# EAGLE design hawb-hat (EAGLE 6.4)
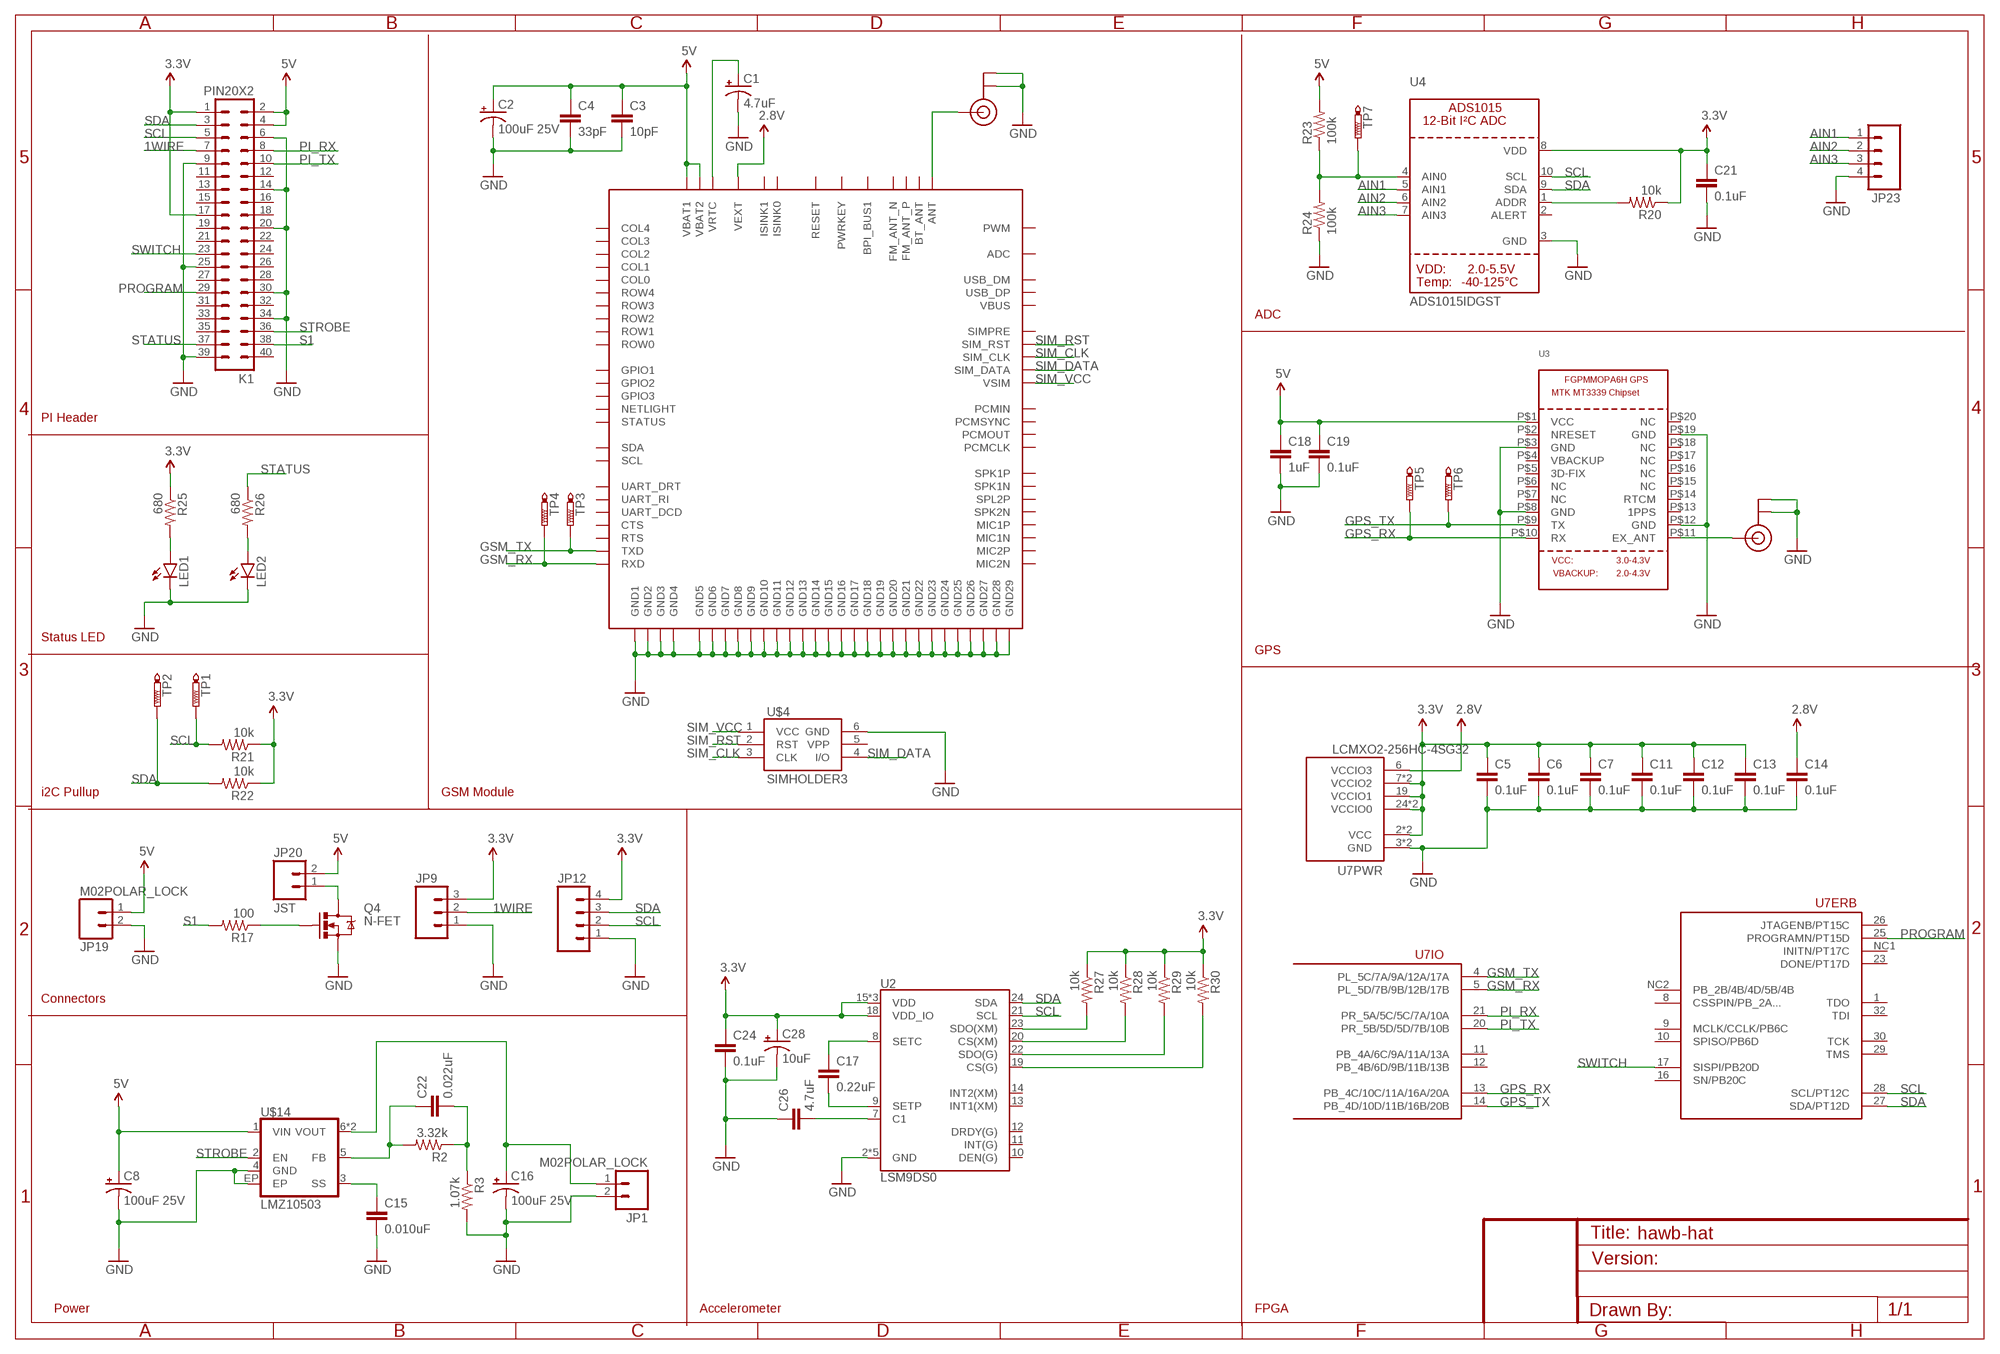
[diagram p0: schematic, sheet 1]

## Parts
C1  4.7uF  CAP_POL1206-KIT  [EIA3216-KIT]
C2  100uF 25V  CAP_POLF80  [NIPPON_F80]
C3  10pF  C-EUC0603  [C0603]
C4  33pF  C-EUC0603  [C0603]
C5  0.1uF  C-EUC0603  [C0603]
C6  0.1uF  C-EUC0603  [C0603]
C7  0.1uF  C-EUC0603  [C0603]
C8  100uF 25V  CAP_POLF80  [NIPPON_F80]
C11  0.1uF  C-EUC0603  [C0603]
C12  0.1uF  C-EUC0603  [C0603]
C13  0.1uF  C-EUC0603  [C0603]
C14  0.1uF  C-EUC0603  [C0603]
C15  0.010uF  C-EUC0603  [C0603]
C16  100uF 25V  CAP_POLF80  [NIPPON_F80]
C17  0.22uF  CAP0603-CAP  [0603-CAP]
C18  1uF  C-EUC0603  [C0603]
C19  0.1uF  C-EUC0603  [C0603]
C21  0.1uF  C-EUC0603  [C0603]
C22  0.022uF  C-EUC0603  [C0603]
C24  0.1uF  CAP0603-CAP  [0603-CAP]
C26  4.7uF  CAP0603-CAP  [0603-CAP]
C28  10uF  CAP_POL1206  [EIA3216]
JP1  M02POLAR_LOCK  [MOLEX-1X2_LOCK]
JP9  M03JST-PTH-VERT  [JST-3-PTH-VERT]
JP12  M04JST-PTH-VERT  [JST-4-PTH-VERT]
JP19  M02POLAR_LOCK  [MOLEX-1X2_LOCK]
JP20  JST  M02JST-PTH-VERT  [JST-2-PTH-VERT]
JP23  M04JST-PTH-VERT  [JST-4-PTH-VERT]
K1  PIN20X2  [PIN_20X2]
LED1  LED1206  [LED-1206]
LED2  LED1206  [LED-1206]
Q4  N-FET  MOSFET-NCHANNELSMD  [SOT23-3]
R2  3.32k  RESISTOR0603-RES  [0603-RES]
R3  1.07k  RESISTOR0603-RES  [0603-RES]
R17  100  RESISTOR0603-RES  [0603-RES]
R20  10k  RESISTOR0603-RES  [0603-RES]
R21  10k  RESISTOR0603-RES  [0603-RES]
R22  10k  RESISTOR0603-RES  [0603-RES]
R23  100k  RESISTOR0603-RES  [0603-RES]
R24  100k  RESISTOR0603-RES  [0603-RES]
R25  680  RESISTOR0603-RES  [0603-RES]
R26  680  RESISTOR0603-RES  [0603-RES]
R27  10k  RESISTOR0603-RES  [0603-RES]
R28  10k  RESISTOR0603-RES  [0603-RES]
R29  10k  RESISTOR0603-RES  [0603-RES]
R30  10k  RESISTOR0603-RES  [0603-RES]
TP1  PTR1PAD1-13  [P1-13]
TP2  PTR1PAD1-13  [P1-13]
TP3  PTR1PAD1-13  [P1-13]
TP4  PTR1PAD1-13  [P1-13]
TP5  PTR1PAD1-13  [P1-13]
TP6  PTR1PAD1-13  [P1-13]
TP7  PTR1PAD1-13  [P1-13]
U2  LSM9DS0  [LGA-24]
U3  GPS_FGPMMOPA6H  [FGPMMOPA6H]
U4  ADS1015IDGST  ADC_ADS1015  [MSOP10]
U7  LCMXO2-256HC-4SG32  [QFN-32]
U$1  U.FL  [U.FL]
U$2  U.FL  [U.FL]
U$4  SIMHOLDER3  [SIMHOLDER3]
U$5  SIM800H  [SIM800]
U$14  LMZ10503  [TO-PMOD-7]

## Nets
1WIRE: JP9.2 K1.7
2.8V: C14.1 U7.6(PWR:VCCIO3) U$5.P$18(VEXT)
3.3V: C5.1 C6.1 C7.1 C11.1 C12.1 C13.1 C21.1 C24.1 C28.A(+) JP9.3 JP12.4 K1.1 K1.17 R20.1 R21.1 R22.1 R25.1 R27.1 R28.1 R29.1 R30.1 U2.15(VDD) U2.16(VDD) U2.17(VDD) U2.18(VDD_IO) U4.8(VDD) U7.2(PWR:VCC) U7.7(PWR:VCCIO2) U7.15(PWR:VCCIO2) U7.18(PWR:VCC) U7.19(PWR:VCCIO1) U7.24(PWR:VCCIO0) U7.31(PWR:VCCIO0)
5V: C2.+ C3.1 C4.1 C8.+ C18.1 C19.1 JP19.1 JP20.2 K1.2 K1.4 R23.2 U3.P$1(VCC) U$5.P$1(VBAT1) U$5.P$42(VBAT2) U$14.1(VIN)
AIN1: JP23.1 U4.5(AIN1)
AIN2: JP23.2 U4.6(AIN2)
AIN3: JP23.3 U4.7(AIN3)
GND: C1.C(-) C2.- C3.2 C4.2 C5.2 C6.2 C7.2 C8.- C11.2 C12.2 C13.2 C14.2 C15.2 C16.- C18.2 C19.2 C21.2 C24.2 C26.1 C28.C(-) JP1.2 JP9.1 JP12.1 JP19.2 JP23.4 K1.6 K1.9 K1.14 K1.20 K1.25 K1.30 K1.34 K1.39 LED1.C LED2.C Q4.2(S) R3.2 R24.1 U2.2(GND) U2.3(GND) U2.4(GND) U2.5(GND) U2.6(GND) U3.P$3(GND) U3.P$8(GND) U3.P$12(GND) U3.P$19(GND) U4.3(GND) U7.3(PWR:GND) U7.22(PWR:GND) U$1.P$1(GND) U$1.P$2(GND) U$2.P$1(GND) U$2.P$2(GND) U$4.6(GND) U$5.P$2(GND1) U$5.P$6(GND10) U$5.P$8(GND11) U$5.P$35(GND5) U$5.P$37(GND6) U$5.P$38(GND7) U$5.P$39(GND8) U$5.P$41(GND12) U$5.P$43(GND2) U$5.P$44(GND3) U$5.P$45(GND4) U$5.P$58(GND9) U$5.P$67(GND13) U$5.P$71(GND14) U$5.P$72(GND15) U$5.P$73(GND16) U$5.P$76(GND17) U$5.P$77(GND18) U$5.P$78(GND19) U$5.P$79(GND20) U$5.P$80(GND21) U$5.P$81(GND22) U$5.P$82(GND23) U$5.P$83(GND24) U$5.P$84(GND25) U$5.P$85(GND26) U$5.P$86(GND27) U$5.P$87(GND28) U$5.P$88(GND29) U$14.4(GND) U$14.EP
GPS_RX: TP5.TP U3.P$10(RX) U7.13(IO:PB_4C/10C/11A/16A/20A)
GPS_TX: TP6.TP U3.P$9(TX) U7.14(IO:PB_4D/10D/11B/16B/20B)
GSM_RX: TP4.TP U7.5(IO:PL_5D/7B/9B/12B/17B) U$5.P$31(RXD)
GSM_TX: TP3.TP U7.4(IO:PL_5C/7A/9A/12A/17A) U$5.P$32(TXD)
N$1: C1.A(+) U$5.P$56(VRTC)
N$2: U$1.P$3(SIGNAL) U$5.P$40(ANT)
N$3: LED1.A R25.2
N$4: C16.+ JP1.1 U$14.6(VOUT) U$14.7(VOUT)
N$5: LED2.A R26.2
N$6: U3.P$11(EX_ANT) U$2.P$3(SIGNAL)
N$13: R27.2 U2.23(SDO(XM))
N$14: R28.2 U2.20(CS(XM))
N$15: JP20.1 Q4.3(D)
N$19: Q4.1(G) R17.1
N$21: C15.1 U$14.3(SS)
N$22: C22.2 R2.1 R3.1
N$24: C22.1 R2.2 U$14.5(FB)
N$27: R20.2 U4.1(ADDR)
N$28: R23.1 R24.2 TP7.TP U4.4(AIN0)
N$31: C17.1 U2.8(SETC)
N$32: C17.2 U2.9(SETP)
N$33: R29.2 U2.22(SDO(G))
N$34: R30.2 U2.19(CS(G))
N$35: C26.2 U2.7(C1)
PI_RX: K1.8 U7.21(IO:PR_5A/5C/5C/7A/10A)
PI_TX: K1.10 U7.20(IO:PR_5B/5D/5D/7B/10B)
PROGRAM: K1.29 U7.25(ERB:PROGRAMN/PT15D)
S1: K1.38 R17.2
SCL: JP12.2 K1.5 R21.2 TP1.TP U2.21(SCL) U4.10(SCL) U7.28(ERB:SCL/PT12C)
SDA: JP12.3 K1.3 R22.2 TP2.TP U2.24(SDA) U4.9(SDA) U7.27(ERB:SDA/PT12D)
SIM_CLK: U$4.3(CLK) U$5.P$55(SIM_CLK)
SIM_DATA: U$4.4(I/O) U$5.P$14(SIM_DATA)
SIM_RST: U$4.2(RST) U$5.P$15(SIM_RST)
SIM_VCC: U$4.1(VCC) U$5.P$16(VSIM)
STATUS: K1.37 R26.1
STROBE: K1.36 U$14.2(EN)
SWITCH: K1.23 U7.17(ERB:SISPI/PB20D)
Unconnected: K1.11 K1.12 K1.13 K1.15 K1.16 K1.18 K1.19 K1.21 K1.22 K1.24 K1.26 K1.27 K1.28 K1.31 K1.32 K1.33 K1.35 K1.40 U2.10(DEN(G)) U2.11(INT(G)) U2.12(DRDY(G)) U2.13(INT1(XM)) U2.14(INT2(XM)) U3.P$2(NRESET) U3.P$4(VBACKUP) U3.P$5(3D-FIX) U3.P$6(NC) U3.P$7(NC) U3.P$13(1PPS) U3.P$14(RTCM) U3.P$15(NC) U3.P$16(NC) U3.P$17(NC) U3.P$18(NC) U3.P$20(NC) U4.2(ALERT) U7.1(ERB:TDO) U7.8(ERB:CSSPIN/PB_2A...) U7.9(ERB:MCLK/CCLK/PB6C) U7.10(ERB:SPISO/PB6D) U7.11(IO:PB_4A/6C/9A/11A/13A) U7.12(IO:PB_4B/6D/9B/11B/13B) U7.16(ERB:SN/PB20C) U7.23(ERB:DONE/PT17D) U7.26(ERB:JTAGENB/PT15C) U7.29(ERB:TMS) U7.30(ERB:TCK) U7.32(ERB:TDI) U7.NC1(ERB:INITN/PT17C) U7.NC2(ERB:PB_2B/4B/4D/5B/4B) U$4.5(VPP) U$5.P$3(GPIO1) U$5.P$4(STATUS) U$5.P$5(BPI_BUS1) U$5.P$7(VBUS) U$5.P$9(MIC2P) U$5.P$10(MIC2N) U$5.P$11(SPK2N) U$5.P$12(MIC1N) U$5.P$13(SPK1N) U$5.P$17(FM_ANT_P) U$5.P$19(USB_DM) U$5.P$20(COL0) U$5.P$21(COL3) U$5.P$22(COL2) U$5.P$23(ROW3) U$5.P$24(COL4) U$5.P$25(COL1) U$5.P$26(PWM) U$5.P$27(GPIO2) U$5.P$28(GPIO3) U$5.P$29(PCMCLK) U$5.P$30(PCMOUT) U$5.P$33(RTS) U$5.P$34(CTS) U$5.P$36(BT_ANT) U$5.P$46(ISINK1) U$5.P$47(ISINK0) U$5.P$48(PWRKEY) U$5.P$49(RESET) U$5.P$50(ADC) U$5.P$51(SPL2P) U$5.P$52(MIC1P) U$5.P$53(SPK1P) U$5.P$54(SIMPRE) U$5.P$57(FM_ANT_N) U$5.P$59(USB_DP) U$5.P$60(ROW1) U$5.P$61(ROW2) U$5.P$62(ROW0) U$5.P$63(ROW4) U$5.P$64(NETLIGHT) U$5.P$65(PCMSYNC) U$5.P$66(PCMIN) U$5.P$68(UART_RI) U$5.P$69(UART_DRT) U$5.P$70(UART_DCD) U$5.P$74(SCL) U$5.P$75(SDA)

## Notes on the sheet
- ADC
- PI Header
- Status LED
- GPS
- i2C Pullup | GSM Module
- Connectors
- Power | Accelerometer | FPGA

## Library data of the parts
C1 C28 = sparkfun:CAP_POL: Capacitor Polarized These are standard SMD and PTH capacitors. Normally 10uF, 47uF, and 100uF in electrolytic and tantalum varieties. Always verify the external diameter of the through hole cap, it varies with capacity, voltage, and manufacturer. The EIA devices should be standard.
C2 C8 C16 = SparkFun-Passives:CAP_POL: Capacitor Polarized These are standard SMD and PTH capacitors. Normally 10uF, 47uF, and 100uF in electrolytic and tantalum varieties. Always verify the external diameter of the through hole cap, it varies with capacity, voltage, and manufacturer. The EIA devices should be standard.
C3-C7 C11-C15 C18 C19 C21 C22 = rcl:C-EU: CAPACITOR, European symbol
C17 C24 C26 = sparkfun:CAP: Capacitor Standard 0603 ceramic capacitor, and 0.1" leaded capacitor.
JP1 JP19 JP20 = SparkFun-Connectors:M02: Standard 2-pin 0.1" header. Use with - straight break away headers ( PRT-00116) - right angle break away headers (PRT-00553) - swiss pins (PRT-00743) - machine pins (PRT-00117) - female headers (PRT-00115) Molex polarized connector foot print use with: PRT-08233 with associated crimp pins and housings. 2.54_SCREWTERM for use with PRT-10571. 3.5mm Screw Terminal footprints for PRT-08084 5mm Screw Terminal footprints for use with PRT-08433
JP9 = SparkFun-Connectors:M03: Header 3 Standard 3-pin 0.1" header. Use with straight break away headers (SKU : PRT-00116), right angle break away headers (PRT-00553), swiss pins (PRT-00743), machine pins (PRT-00117), and female headers (PRT-00115). Molex polarized connector foot print use with SKU : PRT-08232 with associated crimp pins and housings.
JP12 JP23 = SparkFun-Connectors:M04: Header 4 Standard 4-pin 0.1" header. Use with straight break away headers (SKU : PRT-00116), right angle break away headers (PRT-00553), swiss pins (PRT-00743), machine pins (PRT-00117), and female headers (PRT-00115). Molex polarized connector foot print use with SKU : PRT-08231 with associated crimp pins and housings. 1MM SMD Version SKU: PRT-10208
K1 = FLYFISH:PIN20X2
LED1 LED2 = SparkFun-LED:LED: LEDs Standard schematic elements and footprints for 5mm, 3mm, 1206, and 0603 sized LEDs. 5mm - Spark Fun Electronics SKU : COM-00529 (and others)
Q4 = sparkfun:MOSFET-NCHANNEL
R2 R3 R17 R20-R30 = sparkfun:RESISTOR: Resistor Basic schematic elements and footprints for 0603, 1206, and PTH resistors.
TP1-TP7 = testpad:PTR1: TEST PIN
U2 = SparkFun-DigitalIC:LSM9DS0: LSM9DS0 3D Accelerometer, 3D Gyroscope, 3D Magnetomter Features: 3 acceleration channels, 3 angular rate channels, 3 magnetic field channels ±2/±4/±6/±8/±16 g linear acceleration full scale ±2/±4/±8/±12 gauss magnetic full scale ±245/±500/±2000 dps angular rate full scale 16-bit data output SPI / I2C serial interfaces Analog supply voltage 2.4 V to 3.6 V Power-down mode / low-power mode Programmable interrupt generators Embedded self-test Embedded temperature sensor Embedded FIFO Position and motion detection functions Click/double-click recognition
U3 = adafruit:GPS_FGPMMOPA6H: GPS Module - MTK MT3339 Chipset, -165dBm sensitivity, 22 channels, 10Hz, auto-select external antenna options
U4 = microbuilder:ADC_ADS1015: ADS1015 - 12-bit 4-Channel I2C ADC with Internal PGA VDD: 2.0-5.5V Sampling Rate: 3.3ksps Gain Settings: 2/3, 1, 2, 4, 8, 16 I2C Address: ADDR low = 1001000x, ADDR high = 1001001x Internal Comparator The ADS1015 includes an internal comparator that can be set to output a high-level on ALERT when the conversion results exceeeds a pre-defined upper level, and will deassert itself when the level falls below a pre-defined lower threshold level. It can also be set to windowed mode where the ALERT pin will be asserted if the data exceeds the upper threshold or falls below the lower threshold.
U7 = ELL-i-DigitalIC:LCMXO2-256*SG32: MachXO2-256 in 32-pin QFN package. Lattice MachXO2-series FPGA in a 32-pin QFN package, 0.5 mm pitch. Datasheet <http://www.latticesemi.com/~/media/Documents/DataSheets/MachXO23/MachXO2FamilyDataSheet.pdf> (DS1035) .
U$1 U$2 = sparkfun:U.FL
U$4 = sparkfun:SIMHOLDER3
U$5 = SIM800:SIM800H
U$14 = custom:LMZ10503

## Board
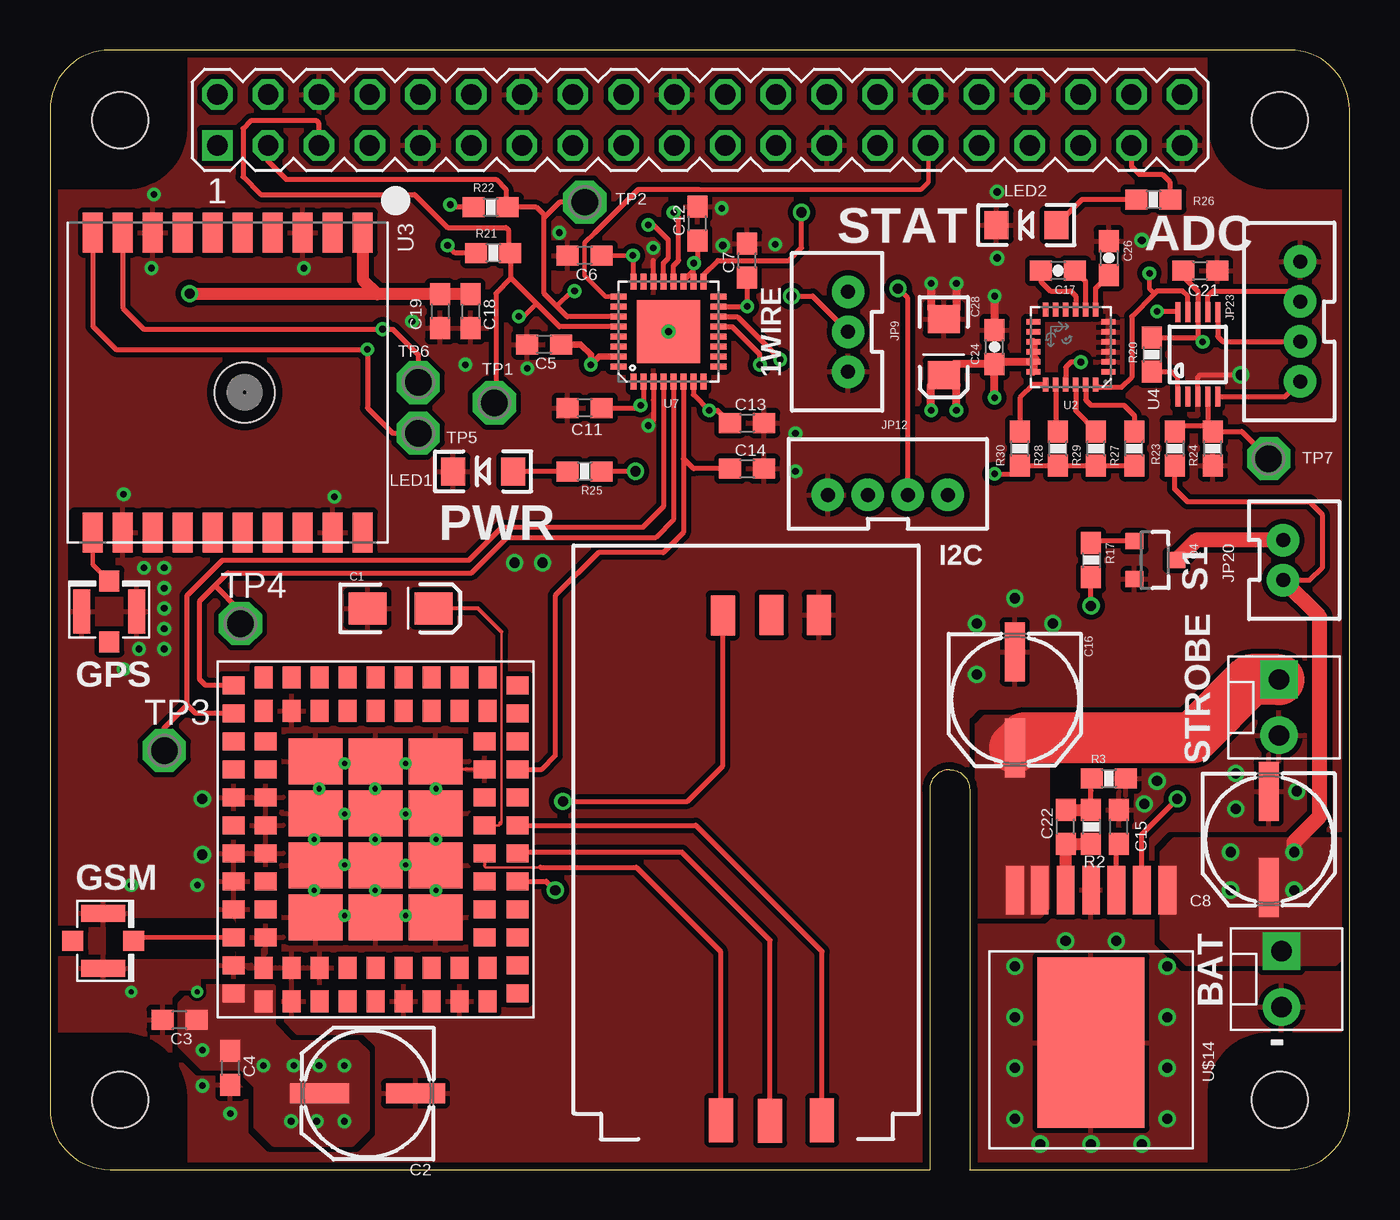
[diagram p1: board, top side]
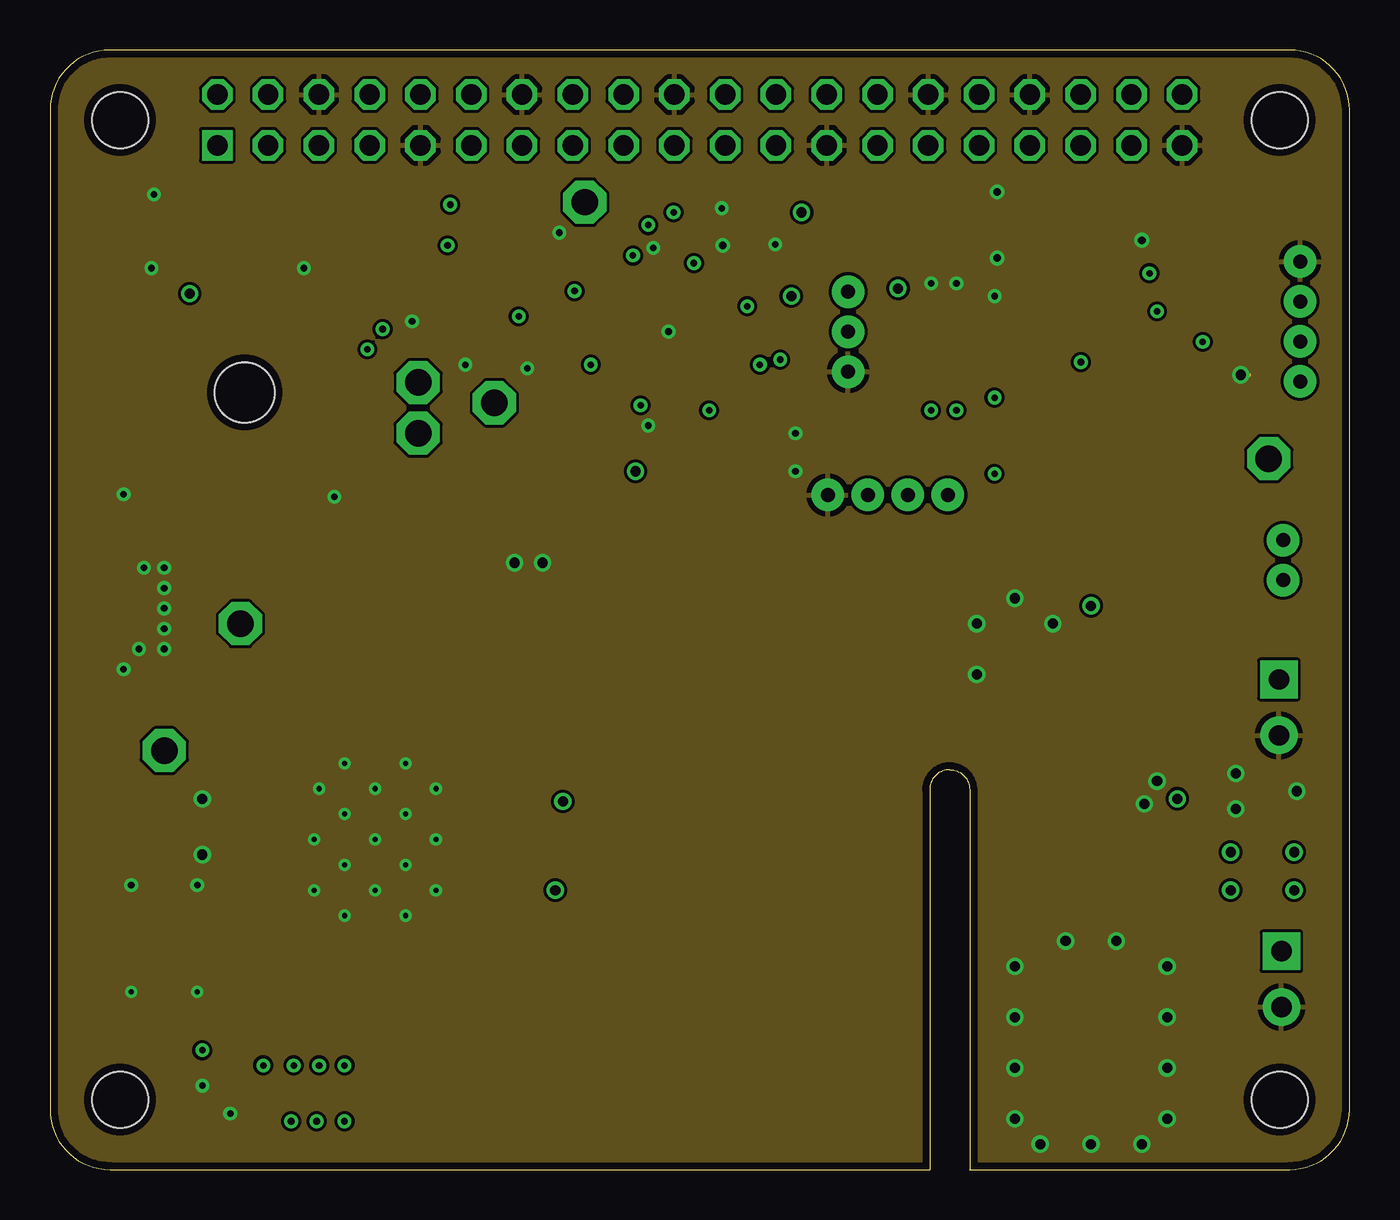
[diagram p2: board, inner layer Route2]
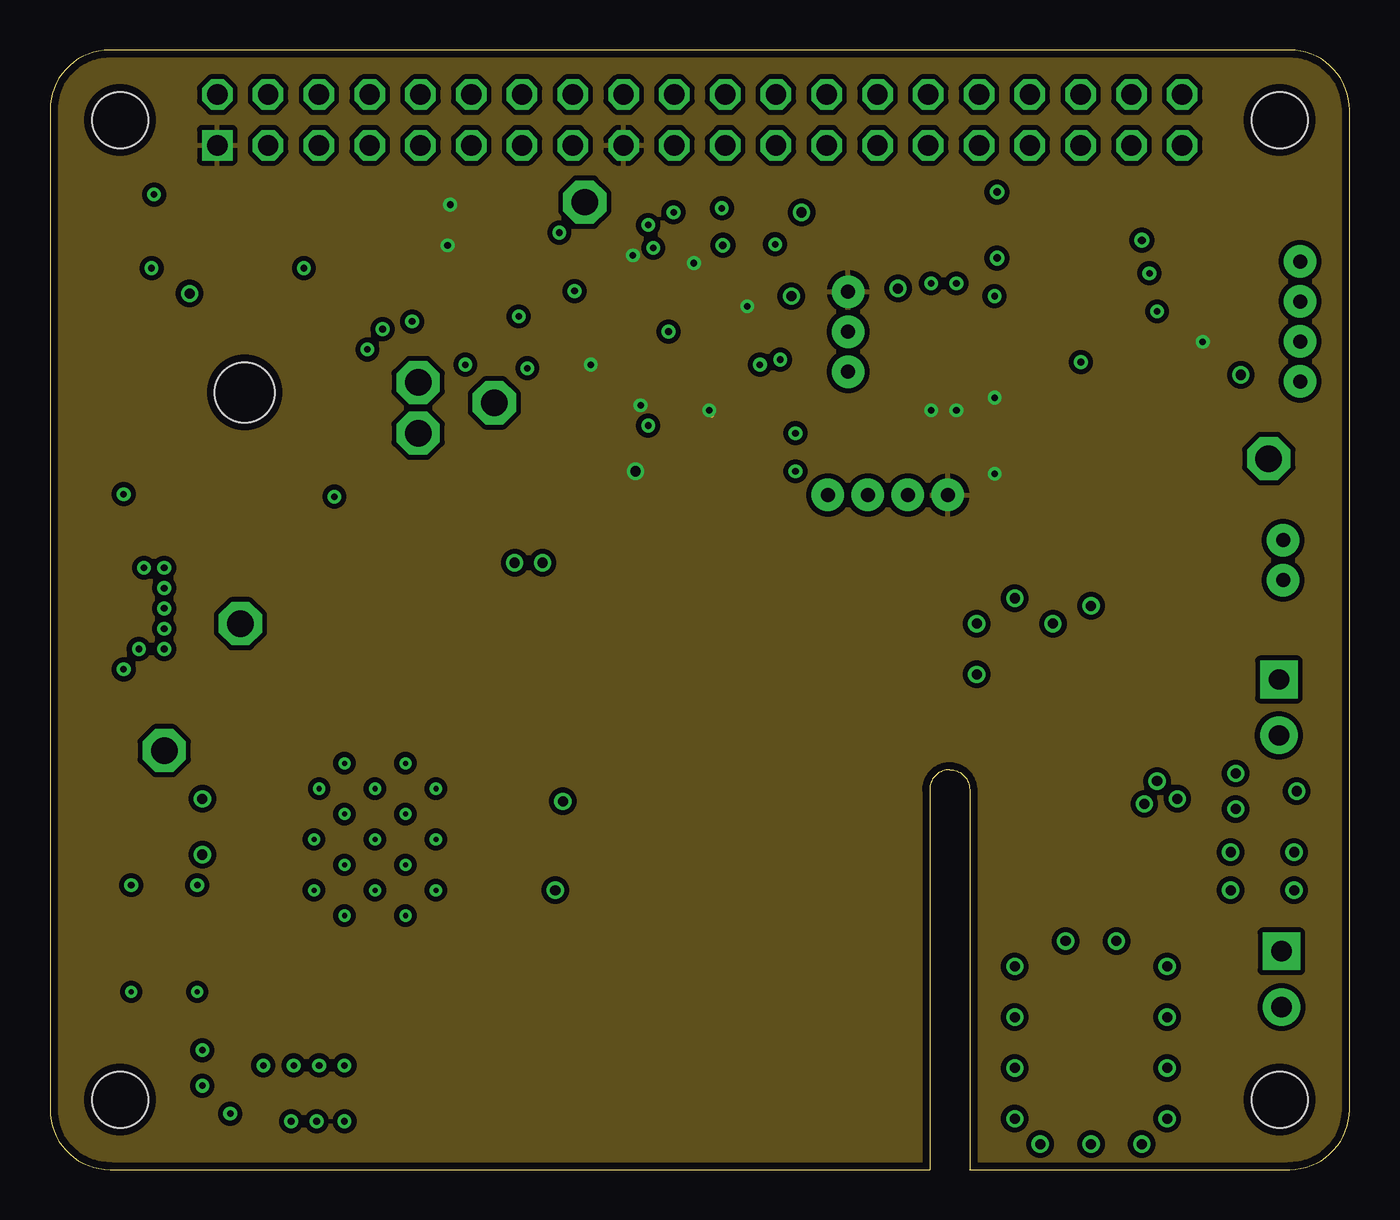
[diagram p3: board, inner layer Route3]
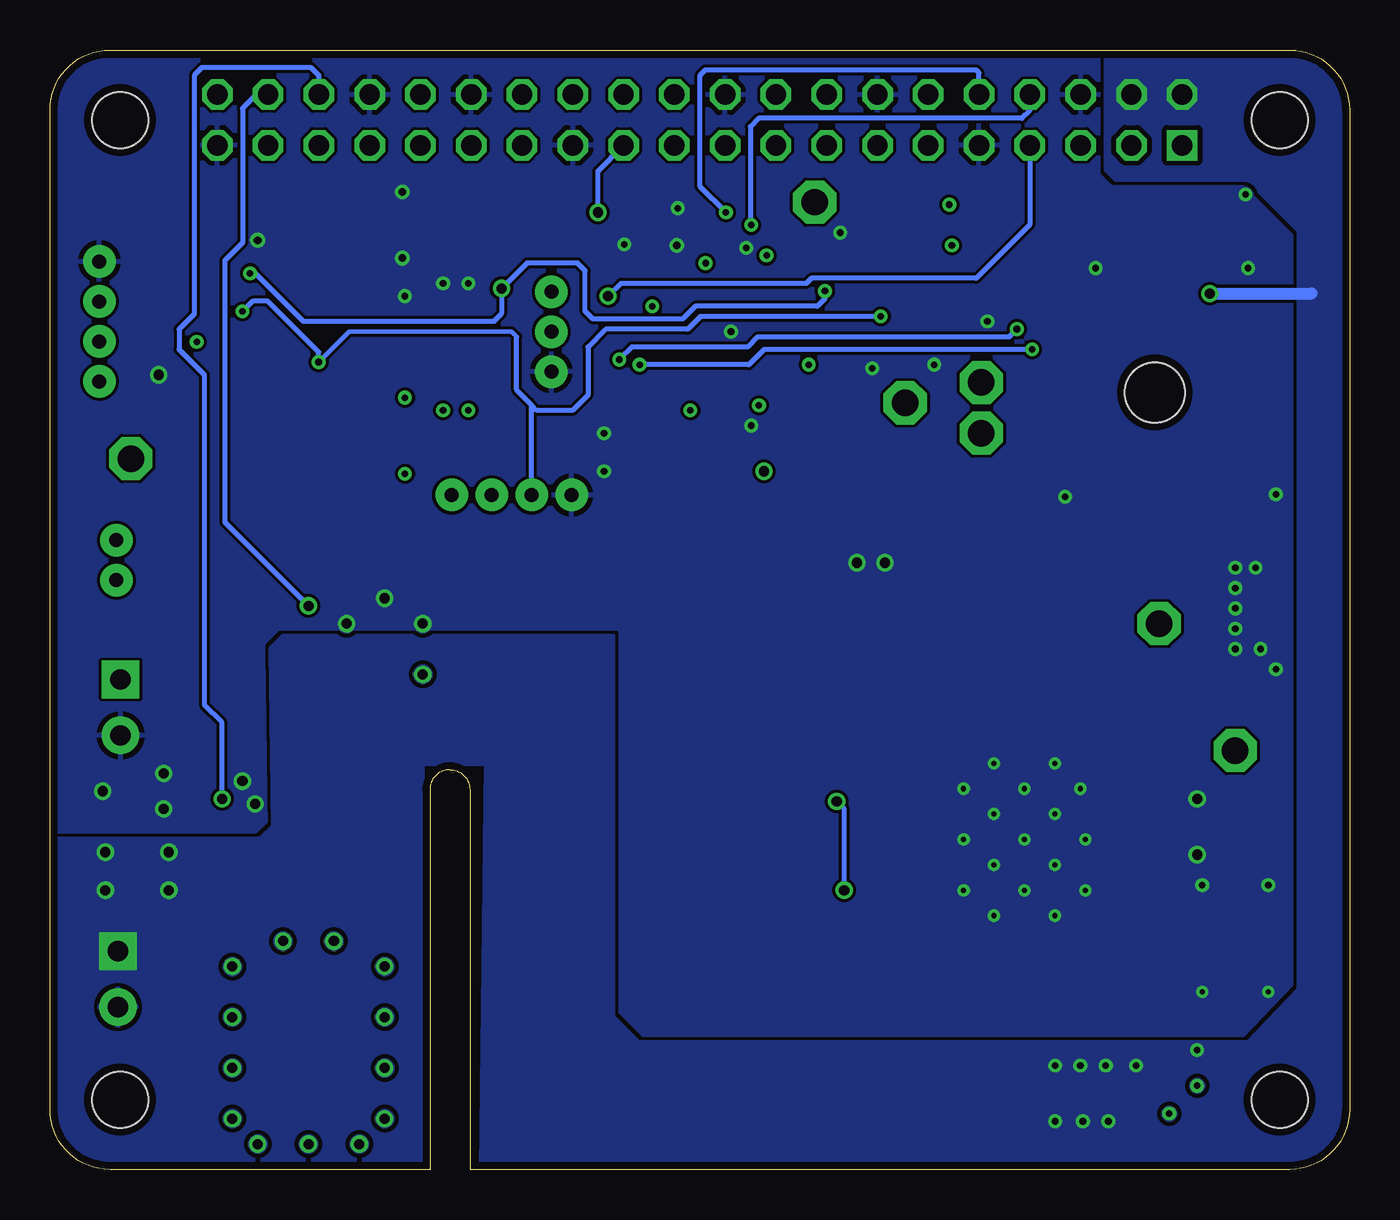
[diagram p4: board, bottom side, seen from below]

Size 65 x 56 mm. Coordinates in mm from the lower left corner, seen from the top.
Outline: 46,0 46,0
Outline: 46,0 62,0 arc90 65,3 65,53 arc90 62,56 3,56 arc90 0,53 0,3 arc90 3,0 44,0 44,19 arc-90 45,20 arc-90 46,19 46,0
Copper layers ((1*2)+(3*16)): Top 0.0356mm / dielectric 1.5011mm / Route2 0.0356mm / dielectric 0.1499mm / Route3 0.0356mm / dielectric 0.2007mm / Bottom 0.0356mm
Design rules "LaenPCBOrder *": minimum track width 5mil, minimum drill 10mil, track to track 6mil, track to pad 6mil, pad to pad 6mil, via to via 6mil, smd to smd 6mil, copper to edge 15mil, drill to drill 6mil, minimum pad ring 4mil, minimum via ring 7mil, stop-mask expansion 4mil, vias tented up to drill 25mil, thermal gap 10mil
Holes 2.8 mm at 3.5,3.5 3.5,52.5 61.5,52.5 61.5,3.5
tRestrict: area 3,10.8 to 9,12.3; area 1.3,29.2 to 2.9,32.8

### Footprints (pad centres in the part's own frame; a part is rotated, then mirrored left to right if it is on the bottom)
EIA3216-KIT = smd 1.9 x 1.6: A 1.65,0; C -1.65,0
NIPPON_F80 = smd 2.95 x 1: + 2.4,0; - -2.4,0
C0603 = smd 1.1 x 1: 1 -0.85,0; 2 0.85,0
0603-CAP = smd 1.1 x 1: 1 -0.85,0; 2 0.85,0
EIA3216 = smd 1.4 x 1.6: A 1.4,0; C -1.4,0
MOLEX-1X2_LOCK = drill 1.016 pad 1.88 square: 1 -0.127,0 | drill 1.016 pad 1.88: 2 2.667,0
JST-3-PTH-VERT = drill 0.7 pad 1.626: 1 -2,-0.55; 2 0,-0.55; 3 2,-0.55
JST-4-PTH-VERT = drill 0.7 pad 1.626: 1 -3,-0.55; 2 -1,-0.55; 3 1,-0.55; 4 3,-0.55
JST-2-PTH-VERT = drill 0.7 pad 1.626: 1 -1,-0.55; 2 1,-0.55
PIN_20X2 = drill 1.016 square: 1 -24.13,-1.27 | drill 1.016 octagon: 2 -24.13,1.27; 3 -21.59,-1.27; 4 -21.59,1.27; 5 -19.05,-1.27; 6 -19.05,1.27; 7 -16.51,-1.27; 8 -16.51,1.27; 9 -13.97,-1.27; 10 -13.97,1.27; 11 -11.43,-1.27; 12 -11.43,1.27; 13 -8.89,-1.27; 14 -8.89,1.27; 15 -6.35,-1.27; 16 -6.35,1.27; 17 -3.81,-1.27; 18 -3.81,1.27; 19 -1.27,-1.27; 20 -1.27,1.27; 21 1.27,-1.27; 22 1.27,1.27; 23 3.81,-1.27; 24 3.81,1.27; 25 6.35,-1.27; 26 6.35,1.27; 27 8.89,-1.27; 28 8.89,1.27; 29 11.43,-1.27; 30 11.43,1.27; 31 13.97,-1.27; 32 13.97,1.27; 33 16.51,-1.27; 34 16.51,1.27; 35 19.05,-1.27; 36 19.05,1.27; 37 21.59,-1.27; 38 21.59,1.27; 39 24.13,-1.27; 40 24.13,1.27
LED-1206 = smd 1.2 x 1.4: A -1.5,0; C 1.5,0
SOT23-3 = smd 0.8 x 0.9: 1 -0.95,-1; 2 0.95,-1; 3 0,1.1
0603-RES = smd 1.1 x 1: 1 -0.85,0; 2 0.85,0
P1-13 = drill 1.321 pad 2.159 octagon: TP 0,0
LGA-24 = smd 0.7 x 0.29: 1 -1.875,1.25; 2 -1.875,0.75; 3 -1.875,0.25; 4 -1.875,-0.25; 5 -1.875,-0.75; 6 -1.875,-1.25; 13 1.875,-1.25; 14 1.875,-0.75; 15 1.875,-0.25; 16 1.875,0.25; 17 1.875,0.75; 18 1.875,1.25 | smd 0.29 x 0.7: 7 -1.25,-1.875; 8 -0.75,-1.875; 9 -0.25,-1.875; 10 0.25,-1.875; 11 0.75,-1.875; 12 1.25,-1.875; 19 1.25,1.875; 20 0.75,1.875; 21 0.25,1.875; 22 -0.25,1.875; 23 -0.75,1.875; 24 -1.25,1.875
FGPMMOPA6H = smd 2 x 1: P$1 -7.5,6.75; P$2 -7.5,5.25; P$3 -7.5,3.75; P$4 -7.5,2.25; P$5 -7.5,0.75; P$6 -7.5,-0.75; P$7 -7.5,-2.25; P$8 -7.5,-3.75; P$9 -7.5,-5.25; P$10 -7.5,-6.75; P$11 7.5,-6.75; P$12 7.5,-5.25; P$13 7.5,-3.75; P$14 7.5,-2.25; P$15 7.5,-0.75; P$16 7.5,0.75; P$17 7.5,2.25; P$18 7.5,3.75; P$19 7.5,5.25; P$20 7.5,6.75 | hole 3: 0.5,0.85
MSOP10 = smd 0.25 x 1: 1 -1,-2.113; 2 -0.5,-2.113; 3 0,-2.113; 4 0.5,-2.113; 5 1,-2.113; 6 1,2.113; 7 0.5,2.113; 8 0,2.113; 9 -0.5,2.113; 10 -1,2.113
QFN-32 = smd 0.285 x 0.8: 1 -1.75,-2.5; 2 -1.25,-2.5; 3 -0.75,-2.5; 4 -0.25,-2.5; 5 0.25,-2.5; 6 0.75,-2.5; 7 1.25,-2.5; 8 1.75,-2.5; 17 1.75,2.5; 18 1.25,2.5; 19 0.75,2.5; 20 0.25,2.5; 21 -0.25,2.5; 22 -0.75,2.5; 23 -1.25,2.5; 24 -1.75,2.5 | smd 0.8 x 0.285: 9 2.5,-1.75; 10 2.5,-1.25; 11 2.5,-0.75; 12 2.5,-0.25; 13 2.5,0.25; 14 2.5,0.75; 15 2.5,1.25; 16 2.5,1.75; 25 -2.5,1.75; 26 -2.5,1.25; 27 -2.5,0.75; 28 -2.5,0.25; 29 -2.5,-0.25; 30 -2.5,-0.75; 31 -2.5,-1.25; 32 -2.5,-1.75 | smd 3.15 x 3.15: EP 0,0 | smd 0 x 0: NC1 0,0; NC2 0,0
U.FL = smd 2.2 x 0.85: P$1 0,1.375; P$2 0,-1.375 | smd 1.05 x 1: P$3 1.525,0; P$4 -1.525,0
SIMHOLDER3 = smd 2.2 x 1.2: 1 0.95,4.81; 2 0.91,7.41; 3 0.95,9.86 | smd 2 x 1.2: 4 26.2,9.78; 5 26.22,7.34; 6 26.22,4.98
SIM800 = smd 1.1 x 0.9: P$1 0.8,-2.3; P$2 0.8,-3.7; P$3 0.8,-5.1; P$4 0.8,-6.5; P$5 0.8,-7.9; P$6 0.8,-9.3; P$7 0.8,-10.7; P$8 0.8,-12.1; P$9 0.8,-13.5; P$22 17,-13.5; P$23 17,-12.1; P$24 17,-10.7; P$25 17,-9.3; P$26 17,-7.9; P$27 17,-6.5; P$28 17,-5.1; P$29 17,-3.7; P$30 17,-2.3; P$43 2.475,-2.3; P$44 2.475,-3.7; P$45 2.475,-5.1; P$46 2.475,-6.5; P$47 2.475,-7.9; P$48 2.475,-9.3; P$49 2.475,-10.7; P$50 2.475,-12.1; P$51 2.475,-13.5; P$60 15.325,-13.5; P$61 15.325,-12.1; P$62 15.325,-10.7; P$63 15.325,-9.3; P$64 15.325,-7.9; P$65 15.325,-6.5; P$66 15.325,-5.1; P$67 15.325,-3.7; P$68 15.325,-2.3 | smd 0.9 x 1.1: P$10 1.2,-15; P$11 2.6,-15; P$12 4,-15; P$13 5.4,-15; P$14 6.8,-15; P$15 8.2,-15; P$16 9.6,-15; P$17 11,-15; P$18 12.4,-15; P$19 13.8,-15; P$20 15.2,-15; P$21 16.6,-15; P$31 16.6,-0.8; P$32 15.2,-0.8; P$33 13.8,-0.8; P$34 12.4,-0.8; P$35 11,-0.8; P$36 9.6,-0.8; P$37 8.2,-0.8; P$38 6.8,-0.8; P$39 5.4,-0.8; P$40 4,-0.8; P$41 2.6,-0.8; P$42 1.2,-0.8; P$52 4,-13.35; P$53 5.4,-13.35; P$54 6.8,-13.35; P$55 8.2,-13.35; P$56 9.6,-13.35; P$57 11,-13.35; P$58 12.4,-13.35; P$59 13.8,-13.35; P$69 13.8,-2.4; P$70 12.4,-2.4; P$71 11,-2.4; P$72 9.6,-2.4; P$73 8.2,-2.4; P$74 6.8,-2.4; P$75 5.4,-2.4; P$76 4,-2.4 | smd 2.3 x 2.7: P$77 5,-4.9; P$78 5,-7.9; P$79 5,-10.9; P$80 7.6,-10.9; P$81 10.2,-10.9; P$82 12.8,-10.9; P$83 12.8,-7.9; P$84 12.8,-4.9; P$85 10.2,-4.9; P$86 7.6,-4.9; P$87 7.6,-7.9; P$88 10.2,-7.9
TO-PMOD-7 = smd 0.89 x 2.41: 1 -3.81,-7.63; 2 -2.54,-7.63; 3 -1.27,-7.63; 4 0,-7.63; 5 1.27,-7.63; 6 2.57,-7.63; 7 3.81,-7.63 | smd 5.35 x 8.54: EP 0,0

### Placement (x,y rotation side)
C1  17.53,28.07 0 top
C2  15.88,3.81 180 top
C3  6.48,7.49 180 top
C4  9.02,5.08 270 top
C5  24.71,41.27 180 top
C6  26.75,45.72 180 top
C7  34.87,45.47 90 top
C8  60.96,16.51 270 top
C11  26.75,38.1 180 top
C12  32.38,47.32 90 top
C13  34.87,37.34 0 top
C14  34.87,35.05 0 top
C15  53.47,17.15 90 top
C16  48.26,23.5 270 top
C17  50.42,44.96 180 top
C18  21.03,42.93 270 top
C19  19.51,42.93 270 top
C21  57.53,44.96 0 top
C22  50.8,17.15 90 top
C24  47.24,41.15 90 top
C26  52.96,45.59 270 top
C28  44.7,41.15 270 top
JP1  61.47,24.38 270 top
JP9  39.37,41.91 90 top
JP12  41.91,34.29 0 top
JP19  61.6,10.8 270 top
JP20  62.23,30.48 270 top
JP23  61.98,42.42 90 top
K1  32.5,52.5 0 top
LED1  21.67,34.93 180 top
LED2  48.84,47.24 180 top
Q4  55.24,30.48 270 top
R2  52.07,17.15 270 top
R3  52.96,19.56 0 top
R17  52.07,30.48 270 top
R20  55.12,40.77 270 top
R21  22.17,45.85 0 top
R22  22.05,48.13 0 top
R23  56.26,36.07 270 top
R24  58.17,36.07 90 top
R25  26.75,34.93 180 top
R26  55.19,48.51 180 top
R27  54.23,36.07 90 top
R28  50.42,36.07 90 top
R29  52.32,36.07 90 top
R30  48.51,36.07 90 top
TP1  22.23,38.35 0 top
TP2  26.75,48.39 0 top
TP3  5.72,20.96 0 top
TP4  9.52,27.3 0 top
TP5  18.41,36.83 0 top
TP6  18.41,39.37 0 top
TP7  60.96,35.56 0 top
U2  51.05,41.15 180 top
U3  8.89,39.37 270 top
U4  57.4,40.77 0 top
U7  30.94,41.91 0 top
U$1  2.67,11.43 0 top
U$2  2.97,27.91 90 top
U$4  43.43,1.52 90 top
U$5  8.38,7.62 90 top
U$14  52.07,6.35 180 top

### Tracks (layer width: path | path; a pad name or v marks a point on that pad's centre or on a via)
1WIRE  (via drill 0.51)
  Top 0.254: v37.08,43.69 38.14,43.69 JP9.2
  Bottom 0.254: K1.7 15.99,47.26 18.67,44.58 26.92,44.58 27.18,44.32 36.45,44.32 v37.08,43.69
2.8V
  Top 0.254: U7.6 31.69,35.56 | 31.69,35.56 31.69,31.87 30.68,30.86 27.43,30.86 25.27,28.7 25.27,20.7 24.59,20.02 U$5.P$18 | C14.1 32.2,35.05 31.69,35.56
3.3V  (via drill 0.33, 0.51)
  Top 0.229: C6.1 v29.16,45.72
  Top 0.254: v47.24,34.8 48.09,34.8 R30.1 R28.1 R29.1 R27.1 | 47.34,40.4 C24.1 | C21.1 56.68,44.66 57.4,43.94 U4.8 57.4,41.66 v57.66,41.4 57.44,41.62 R20.1 | v29.29,34.93 R25.1 | U7.24 29.19,45.69 v29.16,45.72 | U7.18 32.19,44.96 | 32.19,44.96 32.19,45.19 v32.21,45.34 | 32.19,44.96 31.69,44.46 U7.19 | U7.15 34.85,43.16 v34.87,43.18 C7.1 | C11.1 29.41,38.1 v29.54,38.23 29.69,38.37 U7.2 | R22.1 20.14,48.13 v20.02,48.26 | R21.1 20.27,45.85 v19.89,46.23 | U7.7 32.19,38.76 v32.97,37.97 33.39,37.97 C13.1 | 44.7,39.88 C28.A | 32.26,45.26 v32.21,45.34 | C12.1 32.38,45.39 v32.21,45.34
  Top 0.33: C5.1 26.54,41.27 27.05,40.77 v27.05,40.26 27.45,40.66 U7.31
  Top 0.406: U2.17 47.34,40.4 | C24.1 45.25,40.3 C28.A | U2.17 U2.18 | U2.15 U2.16 U2.17 | 49.29,40.51 U2.17 | v44.07,37.97 44.07,39.24 44.7,39.88 45.34,39.24 v45.34,37.97 | v47.24,38.61 47.24,39.88
  Route3 0.254: v32.97,37.97 32.97,37.85 33.1,37.72
  pour Route3 (isolate 0.254, rank 2): 0,55.88 0,0 66.04,0 66.04,55.88
5V  (via drill 0.33, 0.51)
  Top 0.254: 61.7,29.46 62.99,29.46 63.63,30.1 63.63,32.77 62.99,33.4 56.9,33.4 56.26,34.04 R23.2
  Top 0.61: C18.1 C19.1 16.38,43.78 | 16.38,43.78 7.02,43.78 v6.99,43.82 | U3.P$1 15.64,44.52 16.38,43.78
  Top 0.762: v62.23,15.88 62.23,16.38 63.5,17.65 63.5,27.66 61.7,29.46 JP20.2
  Bottom 0.61: v6.99,43.82 1.91,43.82
  other vias: 10.67,5.21 7.62,5.97 12.07,2.41 13.34,2.41 14.73,2.41 14.73,5.21 13.46,5.21 12.19,5.21 59.05,15.88 59.05,13.97 62.23,13.97
  pour Bottom (isolate 0.254, no thermals): 12.19,55.88 12.19,50.04 11.68,49.53 5.08,49.53 2.54,46.99 2.54,9.02 5.08,6.35 35.56,6.35 36.83,7.62 36.83,26.67 53.34,26.67 53.98,26.04 53.85,17.15 54.48,16.51 64.9,16.51 65.02,0 46.36,0 46.36,20.32 43.18,20.32 43.43,0 0,0 0,55.88
  pour Top (no thermals): 11.18,9.14 7.37,9.14 6.48,8.26 6.48,6.22 7.62,5.08 9.4,5.08 10.29,4.19 10.29,2.16 11.18,1.27 15.11,1.27 15.88,2.03 15.88,5.84 15.37,6.35 12.07,6.35 11.18,7.24
  pour Top (no thermals): 56.26,16.51 64.52,16.51 64.52,10.54 64.26,10.29 56.9,10.29 55.63,11.56 55.63,15.88
AIN1
  Top 0.254: U4.5 61.76,38.65 JP23.1
AIN2
  Top 0.254: U4.6 58.4,41.67 58.67,41.4 62.51,41.4 JP23.2
AIN3
  Top 0.254: U4.7 57.9,43.68 58.17,43.94 62,43.94 JP23.3
GND  (via drill 0.25, 0.33, 0.38, 0.51)
  Top 0.152: U$5.P$58 18.41,20.02 U$5.P$82
  Top 0.254: U7.22 30.19,45.45 30.18,45.47 | U7.3 30.19,38.49 30.18,38.48 30.18,37.46 v29.92,37.21 | U4.3 57.4,39.62 57.53,39.75 v59.56,39.75
  Top 0.406: v44.07,44.32 44.07,43.05 44.7,42.42 45.34,43.05 v45.34,44.32 | v47.24,43.69 47.24,41.78
  Route2 0.254: v59.56,39.75 59.94,39.75
  other vias: 48.26,5.08 50.8,11.43 53.34,11.43 55.88,10.16 55.88,7.62 55.88,5.08 55.88,2.54 54.61,1.27 52.07,1.27 49.53,1.27 48.26,7.62 20.78,40.26 18.11,42.42 23.24,30.35 24.64,30.35 14.73,20.32 17.78,20.32 13.46,19.05 16.26,19.05 19.3,19.05 14.73,17.78 17.78,17.78 19.3,16.51 16.26,16.51 13.21,16.51 14.73,15.24 17.78,15.24 19.3,13.97 16.26,13.97 13.21,13.97 14.73,12.7 17.78,12.7 7.62,18.54 7.62,15.75 30.94,41.91 30.18,46.1 25.48,46.86 3.68,33.78 5.21,48.77 5.08,45.09 12.7,45.09 14.22,33.66 4.7,30.1 5.72,30.1 5.72,29.08 5.72,28.07 5.72,27.05 5.72,26.04 4.45,26.04 3.68,25.02 4.06,14.22 7.37,14.22 7.37,8.89 4.06,8.89 7.62,4.19 9.02,2.79 37.29,36.83 37.29,34.93 33.6,48.08 36.27,46.28 23.88,40.08 48.26,28.57 50.16,27.3 46.36,27.3 46.36,24.77 33.66,46.23 47.37,48.9 47.37,45.59 54.61,46.48 54.74,18.29 59.31,19.81 48.26,10.16 48.26,2.54 55.37,19.43 62.36,18.92 59.31,18.03
  pour Route2: 0,55.88 0,0 66.04,0 66.04,55.88
  pour Top (isolate 0.254, rank 6): 0,48.9 0,6.98 3.81,6.98 arc-90 6.99,3.18 6.99,0 57.79,0 57.79,3.81 arc-90 60.96,6.98 64.77,6.98 64.77,48.9 61.6,48.9 arc-90 57.79,52.07 57.79,55.88 6.99,55.88 6.99,52.07 arc-90 3.81,48.9
  pour Bottom (rank 6): 0,55.88 0,0 66.04,0 66.04,55.88
GPS_RX  (via drill 0.33)
  Top 0.254: v35.51,40.26 35.51,40.77 34.12,42.16 U7.13 | U3.P$10 2.14,42.18 3.3,41.02 v15.88,41.02 15.88,38.1 17.14,36.83 TP5.TP
  Bottom 0.254: v15.88,41.02 29.29,41.02 30.05,40.26 v35.51,40.26
GPS_TX  (via drill 0.33)
  Top 0.254: U7.14 34.38,42.66 v36.52,40.51 | U3.P$9 3.64,43.1 4.7,42.04 v16.64,42.04 17.14,42.04 18.41,40.77 TP6.TP
  Bottom 0.254: v36.52,40.51 35.89,41.15 30.1,41.15 29.59,41.66 17.02,41.66 v16.64,42.04
GSM_RX
  Top 0.254: U$5.P$31 7.78,24.22 7.49,24.51 7.49,28.45 8.25,29.21 | 8.25,29.21 8.89,29.85 21.08,29.85 22.86,31.62 30.3,31.62 31.19,32.51 U7.5 | TP4.TP 9.52,27.94 8.25,29.21
GSM_TX
  Top 0.254: U$5.P$32 7.28,22.82 6.86,23.24 | 6.86,23.24 6.86,28.7 8.64,30.48 20.96,30.48 22.61,32.13 29.67,32.13 30.69,33.15 U7.4 | TP3.TP 5.72,22.1 6.86,23.24
N$1
  Top 0.127: U$5.P$56 22.45,17.22 22.53,17.3 | 22.53,17.32 22.58,17.37 22.58,26.9
  Top 0.203: 22.53,17.3 22.53,17.32 | 22.58,26.9 21.41,28.07 C1.A
N$2
  Top 0.229: U$5.P$40 4.38,11.62 U$1.P$3
N$3
  Top 0.254: R25.2 LED1.A
N$4
  Top 2.54: JP1.1 60.07,24.51 57.15,21.59 48.76,21.59 C16.+
  pour Top (no thermals): 49.91,13.08 49.91,22.61 46.74,22.61 46.36,22.23 46.36,12.7 49.53,12.7
N$5
  Top 0.254: R26.2 51.61,48.51 LED2.A
N$6
  Top 0.229: U3.P$11 2.14,30.27 U$2.P$3
N$13
  Top 0.254: U2.23 51.8,38.49 52.07,38.23 53.72,38.23 54.23,37.72 R27.2
N$14
  Top 0.254: U2.20 50.3,37.03 R28.2
N$15
  Top 0.762: JP20.1 57.34,31.48 Q4.3
N$19
  Top 0.254: Q4.1 52.17,31.43 R17.1
N$21
  Top 0.254: U$14.3 53.34,16.17 C15.1
N$22
  Top 0.254: R2.1 52.07,18.96 R3.1
  Top 0.61: C22.2 R2.1
N$24
  Top 0.61: U$14.5 C22.1 R2.2
N$27
  Top 0.254: U4.1 56.4,39.61 56.13,39.88 55.16,39.88 R20.2
N$28
  Top 0.254: U4.4 57.9,37.18 | 57.9,37.18 R24.2 59.6,36.92 TP7.TP | 57.9,37.18 56.52,37.18 R23.1
N$31
  Top 0.254: U2.8 51.8,44.42 C17.1
N$32
  Top 0.254: C17.2 49.57,44.41 50.04,43.94 51.05,43.94 51.31,43.69 U2.9
N$33
  Top 0.254: U2.22 51.3,37.94 R29.2
N$34
  Top 0.254: U2.19 49.18,39.27 48.51,38.61 R30.2
N$35
  Top 0.254: U2.7 52.3,44.09 C26.2
PI_RX  (via drill 0.33)
  Top 0.254: v29.92,47.24 30.18,47.24 30.94,46.48 30.94,45.59 30.69,45.34 U7.21
  Bottom 0.254: K1.8 15.99,52.97 16.38,52.58 29.57,52.58 29.97,52.17 29.97,47.3 v29.92,47.24
PI_TX  (via drill 0.33)
  Top 0.254: U7.20 31.19,45.21 31.45,45.47 31.45,47.63 v31.19,47.88
  Bottom 0.254: K1.10 18.53,54.85 18.67,54.99 32.23,54.99 32.51,54.71 32.51,49.2 v31.19,47.88
PROGRAM
  Top 0.229: K1.29 43.93,49.39 43.56,49.02 32.46,49.02 | 27.25,46.86 26.75,46.35 26.75,44.7 27.79,43.66 U7.25
  Top 0.254: 32.46,49.02 29.41,49.02 27.25,46.86
S1  (via drill 0.51)
  Top 0.254: v52.07,28.19 R17.2
  Bottom 0.254: K1.38 54.69,53.77 55.37,53.09 55.37,46.35 56.26,45.47 56.26,32.38 v52.07,28.19
SCL  (via drill 0.33)
  Top 0.229: v23.44,42.67 23.7,42.67 24.33,43.31
  Top 0.254: 50.8,39.63 U2.21 50.8,40.13 51.05,40.39 v51.56,40.39 | v55.37,42.93 56.36,42.93 U4.10 | K1.5 13.45,52.34 13.34,52.45 10.03,52.45 9.65,52.07 9.65,49.66 10.54,48.77 18.24,48.77 19.89,47.12 22.81,47.12 22.94,46.99 22.94,45.94 R21.2 23.06,45.81 23.06,44.58 | U7.28 25.48,42.16 24.33,43.31 23.06,44.58 | 23.06,44.58 22.3,43.82 22.3,38.43 TP1.TP
  Bottom 0.229: 41.66,41.66 41.91,41.91 50.04,41.91 v51.56,40.39
  Bottom 0.254: v51.56,40.39 51.56,40.89 54.1,43.43 54.86,43.43 v55.37,42.93 | v23.44,42.67 32.46,42.67 33.1,42.04 37.21,42.04 38.1,41.15 38.1,38.74 38.86,37.97 40.66,37.97 40.91,38.23 | JP12.2 40.91,38.23 | 40.91,38.23 41.04,38.37 41.66,38.99 41.66,41.66
SDA  (via drill 0.33, 0.51)
  Top 0.229: v26.24,43.94 26.11,43.94 25.35,43.18 | v54.99,44.83 54.99,44.07 55.24,43.82
  Top 0.254: U4.9 56.9,43.68 56.64,43.94 55.37,43.94 55.24,43.82 54.1,42.67 54.1,39.62 53.59,39.12 52.46,39.12 U2.24 | K1.3 10.91,50.43 11.81,49.53 22.3,49.53 22.81,49.02 22.81,48.22 R22.2 24.33,48.13 24.71,47.75 24.71,47.63 | U7.27 25.87,42.66 25.35,43.18 24.71,43.82 24.71,47.63 | TP2.TP 25.48,48.39 24.71,47.63 | JP12.3 42.91,43.58 v42.42,44.07
  Bottom 0.229: 54.74,44.83 v54.99,44.83
  Bottom 0.254: v26.24,43.94 26.24,43.56 26.62,43.18 32.72,43.18 33.35,42.55 37.85,42.55 38.23,42.93 38.23,44.96 38.61,45.34 41.15,45.34 v42.42,44.07 42.42,42.8 42.8,42.42 52.32,42.42 54.74,44.83
SIM_CLK
  Top 0.127: 21.73,15.23 21.73,15.17 21.79,15.11 24.54,15.11
  Top 0.152: U$5.P$55 21.73,15.23
  Top 0.254: U$4.3 33.53,2.52 33.53,10.92 29.34,15.11 24.54,15.11
SIM_DATA  (via drill 0.51)
  Top 0.254: U$5.P$14 24.82,14.42 v25.27,13.97 | v25.65,18.41 31.88,18.41 33.66,20.19 U$4.4
  Bottom 0.254: v25.27,13.97 25.27,18.03 v25.65,18.41
SIM_RST
  Top 0.254: U$4.2 36.02,11.47 31.62,15.88 23.44,15.88 U$5.P$15
SIM_VCC
  Top 0.254: U$5.P$16 32.31,17.22 38.62,10.91 U$4.1
STATUS
  Top 0.254: K1.37 54.09,50.18 54.48,49.78 55.63,49.78 56.01,49.4 56.01,48.55 R26.1
STROBE  (via drill 0.51)
  Top 0.254: U$14.2 54.61,16.76 v56.39,18.54
  Bottom 0.254: K1.36 51.55,54.73 51.94,55.12 57.4,55.12 57.79,54.74 57.79,42.8 58.55,42.04 58.55,41.02 57.28,39.75 57.28,23.24 56.39,22.35 v56.39,18.54
SWITCH  (via drill 0.51)
  Top 0.254: U7.17 32.69,44.75 33.4,45.47 36.96,45.47 37.59,46.1 v37.59,47.88
  Bottom 0.254: v37.59,47.88 37.59,49.95 K1.23

### Text on the board
tPlace: STAT | ADC | 1WIRE | PWR | I2C | S1 | GPS | STROBE | GSM | BAT | -